# EAGLE design MySXSenors (EAGLE 6.6.0)
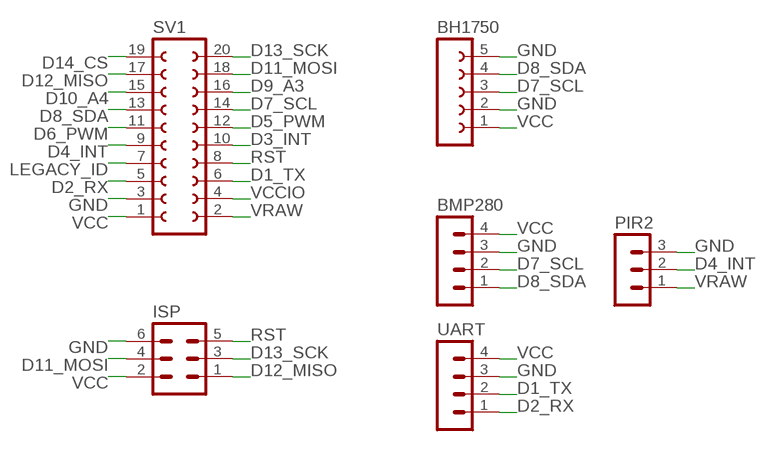
[diagram p0: schematic, sheet 1]

## Parts
BH1750  FE05-1  [FE05-1]
BMP280  MA04-1  [MA04-1]
ISP  MA03-2  [MA03-2]
PIR2  MA03-1  [MA03-1]
SV1  FE10-2  [FE10-2]
UART  MA04-1  [MA04-1]

## Nets
D1_TX: SV1.6 UART.2
D2_RX: SV1.5 UART.1
D3_INT: SV1.10
D4_INT: PIR2.2 SV1.9
D5_PWM: SV1.12
D6_PWM: SV1.11
D7_SCL: BH1750.3 BMP280.2 SV1.14
D8_SDA: BH1750.4 BMP280.1 SV1.13
D9_A3: SV1.16
D10_A4: SV1.15
D11_MOSI: ISP.4 SV1.18
D12_MISO: ISP.1 SV1.17
D13_SCK: ISP.3 SV1.20
D14_CS: SV1.19
GND [power]: BH1750.2 BH1750.5 BMP280.3 ISP.6 PIR2.3 SV1.3 UART.3
LEGACY_ID: SV1.7
RST: ISP.5 SV1.8
VCC [power]: BH1750.1 BMP280.4 ISP.2 SV1.1 UART.4
VCCIO [power]: SV1.4
VRAW [power]: PIR2.1 SV1.2

## Library data of the parts
BH1750 = con-lsta:FE05-1: FEMALE HEADER; OC_FARNELL: unknown; OC_NEWARK: unknown
BMP280 UART = con-lstb:MA04-1: PIN HEADER; OC_FARNELL: unknown; OC_NEWARK: unknown
ISP = con-lstb:MA03-2: PIN HEADER; OC_FARNELL: unknown; OC_NEWARK: unknown
PIR2 = con-lstb:MA03-1: PIN HEADER; OC_FARNELL: unknown; OC_NEWARK: unknown
SV1 = my-con-lsta:FE10-2: FEMALE HEADER; OC_FARNELL: unknown; OC_NEWARK: unknown

## Net classes
0 default: width 0.203 mm
1 power: width 0.508 mm

## Board
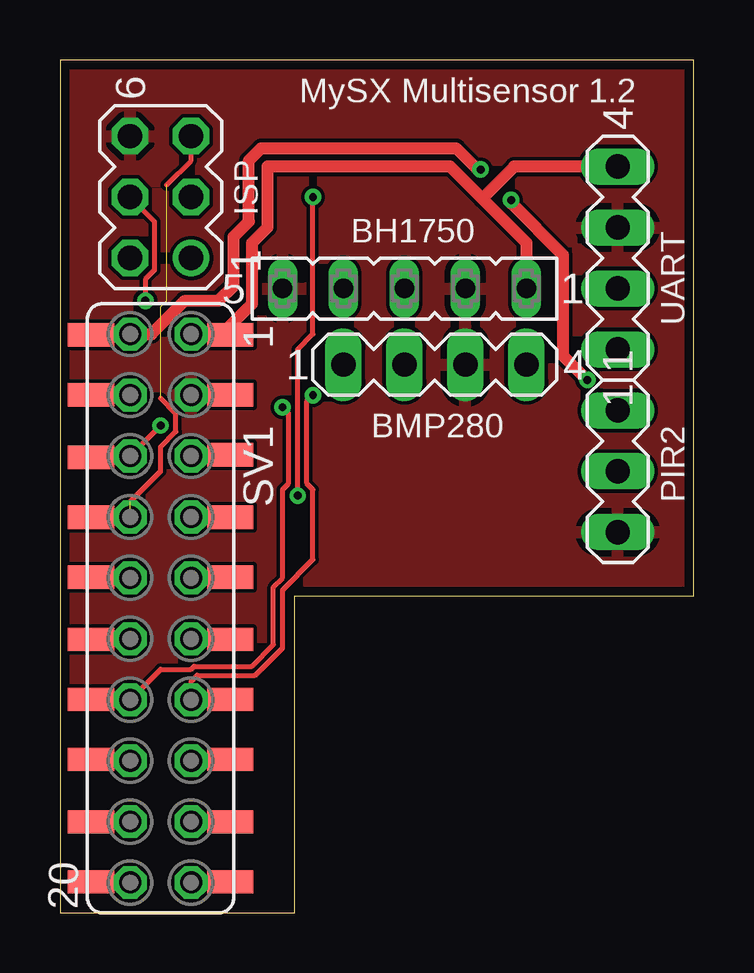
[diagram p1: board, top side]
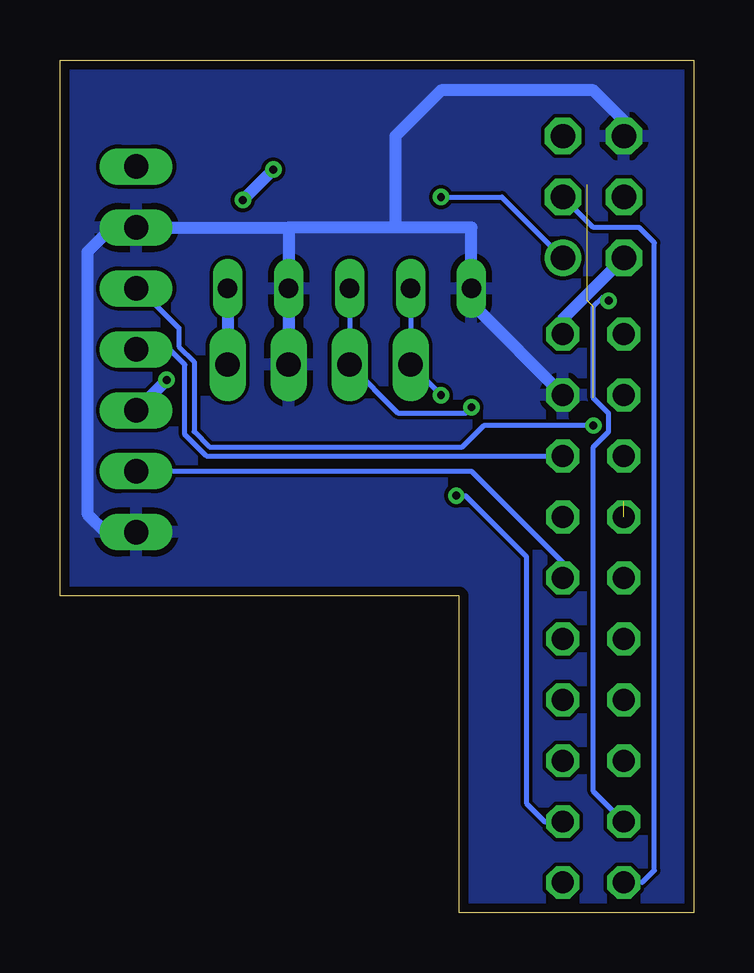
[diagram p2: board, bottom side, seen from below]

Size 26.42 x 35.56 mm. Coordinates in mm from the lower left corner, seen from the top.
Outline: 0,0 9.78,0 9.78,13.21 26.42,13.21 26.42,35.56 0,35.56 0,0
Copper layers (1*16): Top 0.0356mm / dielectric 1.5011mm / Bottom 0.0356mm
Design rules "PCBs_io": minimum track width 6mil, minimum drill 13mil, track to track 6mil, track to pad 6mil, pad to pad 6mil, via to via 6mil, smd to smd 6mil, copper to edge 15mil, drill to drill 6mil, minimum pad ring 7mil, minimum via ring 7mil, stop-mask expansion 3mil, vias tented up to drill 0mil, thermal gap 10mil

### Footprints (pad centres in the part's own frame; a part is rotated, then mirrored left to right if it is on the bottom)
FE05-1 = drill 0.813 long: 1 -5.08,0; 2 -2.54,0; 3 0,0; 4 2.54,0; 5 5.08,0
MA04-1 = drill 1.016 long: 1 -3.81,0; 2 -1.27,0; 3 1.27,0; 4 3.81,0
MA03-2 = drill 1.016: 1 -2.54,-1.27 | drill 1.016 octagon: 2 -2.54,1.27; 3 0,-1.27; 4 0,1.27; 5 2.54,-1.27; 6 2.54,1.27
MA03-1 = drill 1.016 long: 1 -2.54,0; 2 0,0; 3 2.54,0
FE10-2 = drill 0.914 octagon: 1 -11.43,1.27; 2 -11.43,-1.27; 3 -8.89,1.27; 4 -8.89,-1.27; 5 -6.35,1.27; 6 -6.35,-1.27; 7 -3.81,1.27; 8 -3.81,-1.27; 9 -1.27,1.27; 10 -1.27,-1.27; 11 1.27,1.27; 12 1.27,-1.27; 13 3.81,1.27; 14 3.81,-1.27; 15 6.35,1.27; 16 6.35,-1.27; 17 8.89,1.27; 18 8.89,-1.27; 19 11.43,1.27; 20 11.43,-1.27 | smd 0.965 x 1.93: P$1 -8.9,2.9; P$2 -11.4,2.9; P$3 -11.4,-2.9; P$4 -8.9,-2.9; P$5 -6.4,2.9; P$6 -3.8,2.9; P$7 -1.3,2.9; P$8 1.3,2.9; P$9 3.8,2.9; P$10 6.3,2.9; P$11 8.9,2.9; P$12 11.4,2.9; P$13 -6.3,-2.9; P$14 -3.8,-2.9; P$15 -1.3,-2.9; P$16 1.3,-2.9; P$17 3.8,-2.9; P$18 6.3,-2.9; P$19 8.9,-2.9; P$20 11.4,-2.9

### Placement (x,y rotation side)
BH1750  14.35,26.04 180 top
BMP280  15.62,22.86 0 top
ISP  4.19,29.84 90 top
PIR2  23.24,18.41 270 top
SV1  4.19,12.7 270 top
UART  23.24,27.3 90 top

### Tracks (layer width: path | path; a pad name or v marks a point on that pad's centre or on a via)
D1_TX  (via drill 0.33)
  Top 0.203: v4.19,20.32 SV1.6
  Bottom 0.203: v4.19,20.32 8.76,20.32 9.65,19.43 20.19,19.43 20.83,20.07 20.83,22.99 21.46,23.62 21.46,24.38 23.11,26.04 UART.2
D2_RX
  Bottom 0.203: SV1.5 20.32,19.05 21.21,19.94 21.21,22.86 21.84,23.5 UART.1
D4_INT
  Bottom 0.203: PIR2.2 9.27,18.41 5.46,14.61 SV1.9
D7_SCL  (via drill 0.33)
  Top 0.203: v9.27,21.08 9.53,20.83 9.53,17.91 9.27,17.65 9.27,13.97 8.89,13.59 8.89,11.18 8,10.29 5.59,10.29 5.46,10.16 4.19,10.16 SV1.14
  Bottom 0.203: BH1750.3 BMP280.2 12.32,20.83 9.53,20.83 v9.27,21.08
D8_SDA  (via drill 0.33)
  Top 0.203: v10.54,21.59 10.29,21.34 10.29,17.91 10.54,17.65 10.54,14.73 9.27,13.46 9.27,11.05 8.13,9.91 5.71,9.91 5.46,9.65 SV1.13
  Bottom 0.203: BH1750.4 BMP280.1 v10.54,21.59
D11_MOSI  (via drill 0.33)
  Top 0.203: v3.56,25.53 3.56,26.42 3.94,26.8 3.94,28.83 ISP.4
  Bottom 0.203: SV1.18 4.19,5.08 4.19,19.43 3.56,20.07 3.56,20.83 4.19,21.46 4.19,25.27 3.81,25.65 3.68,25.53 v3.56,25.53
D12_MISO  (via drill 0.33)
  Top 0.203: v9.91,17.4 9.91,23.5 10.54,24.13 v10.54,29.84
  Bottom 0.203: v10.54,29.84 8,29.84 ISP.1 | v9.91,17.4 9.53,17.4 6.99,14.86 6.99,4.57 6.22,3.81 SV1.17
D13_SCK
  Bottom 0.203: ISP.3 4.19,28.57 2.29,28.57 1.65,27.94 1.65,1.78 2.16,1.27 SV1.20
GND
  Bottom 0.508: PIR2.3 24.51,15.88 25.27,16.64 25.27,27.56 24.38,28.45 UART.3 | 16.89,28.57 BH1750.2 BMP280.3 | BH1750.5 9.27,28.57 12.45,28.57 | 12.45,28.57 16.89,28.57 | BH1750.5 9.27,25.4 | ISP.6 2.92,33.02 4.19,34.29 10.54,34.29 12.45,32.38 12.45,28.57 | 24.26,28.57 UART.3 | UART.3 16.89,28.57 | SV1.3 9.14,25.27 BH1750.5
  pour Bottom: 0,0 9.78,0 9.78,13.21 26.42,13.21 26.42,35.56 0,35.56
  pour Top: 0,0 9.78,0 9.78,13.21 26.42,13.21 26.42,35.56 0,35.56
RST  (4 unrouted)
  Top 0.203: 2.92,17.14 4.19,18.41 4.19,19.43 4.83,20.07 4.83,20.83 4.19,21.46 | 4.45,30.35 5.46,31.37 ISP.5
VCC
  Top 0.508: BH1750.1 19.43,27.94 17.59,29.78 | 17.59,29.78 16.26,31.11 8.64,31.11 8.64,28.57 8,27.94 8,25.4 6.73,24.13 SV1.1 | UART.4 18.92,31.11 17.59,29.78
  Bottom 0.508: BH1750.1 BMP280.4 | ISP.2 5.46,24.77 SV1.1
VRAW  (via drill 0.33)
  Top 0.508: v21.97,22.23 20.95,23.24 20.95,27.43 18.8,29.59 v18.8,29.72 | v17.53,30.99 17.4,30.99 16.51,31.88 8.38,31.88 7.87,31.37 7.87,28.83 7.24,28.19 7.24,26.16 6.6,25.53 5.21,25.53 3.81,24.13 SV1.2
  Bottom 0.508: v21.97,22.23 PIR2.1 | v17.53,30.99 v18.8,29.72

### Text on the board
tNames: MySX Multisensor 1.2